# EAGLE design papertape_pcb (EAGLE 7.6.0)
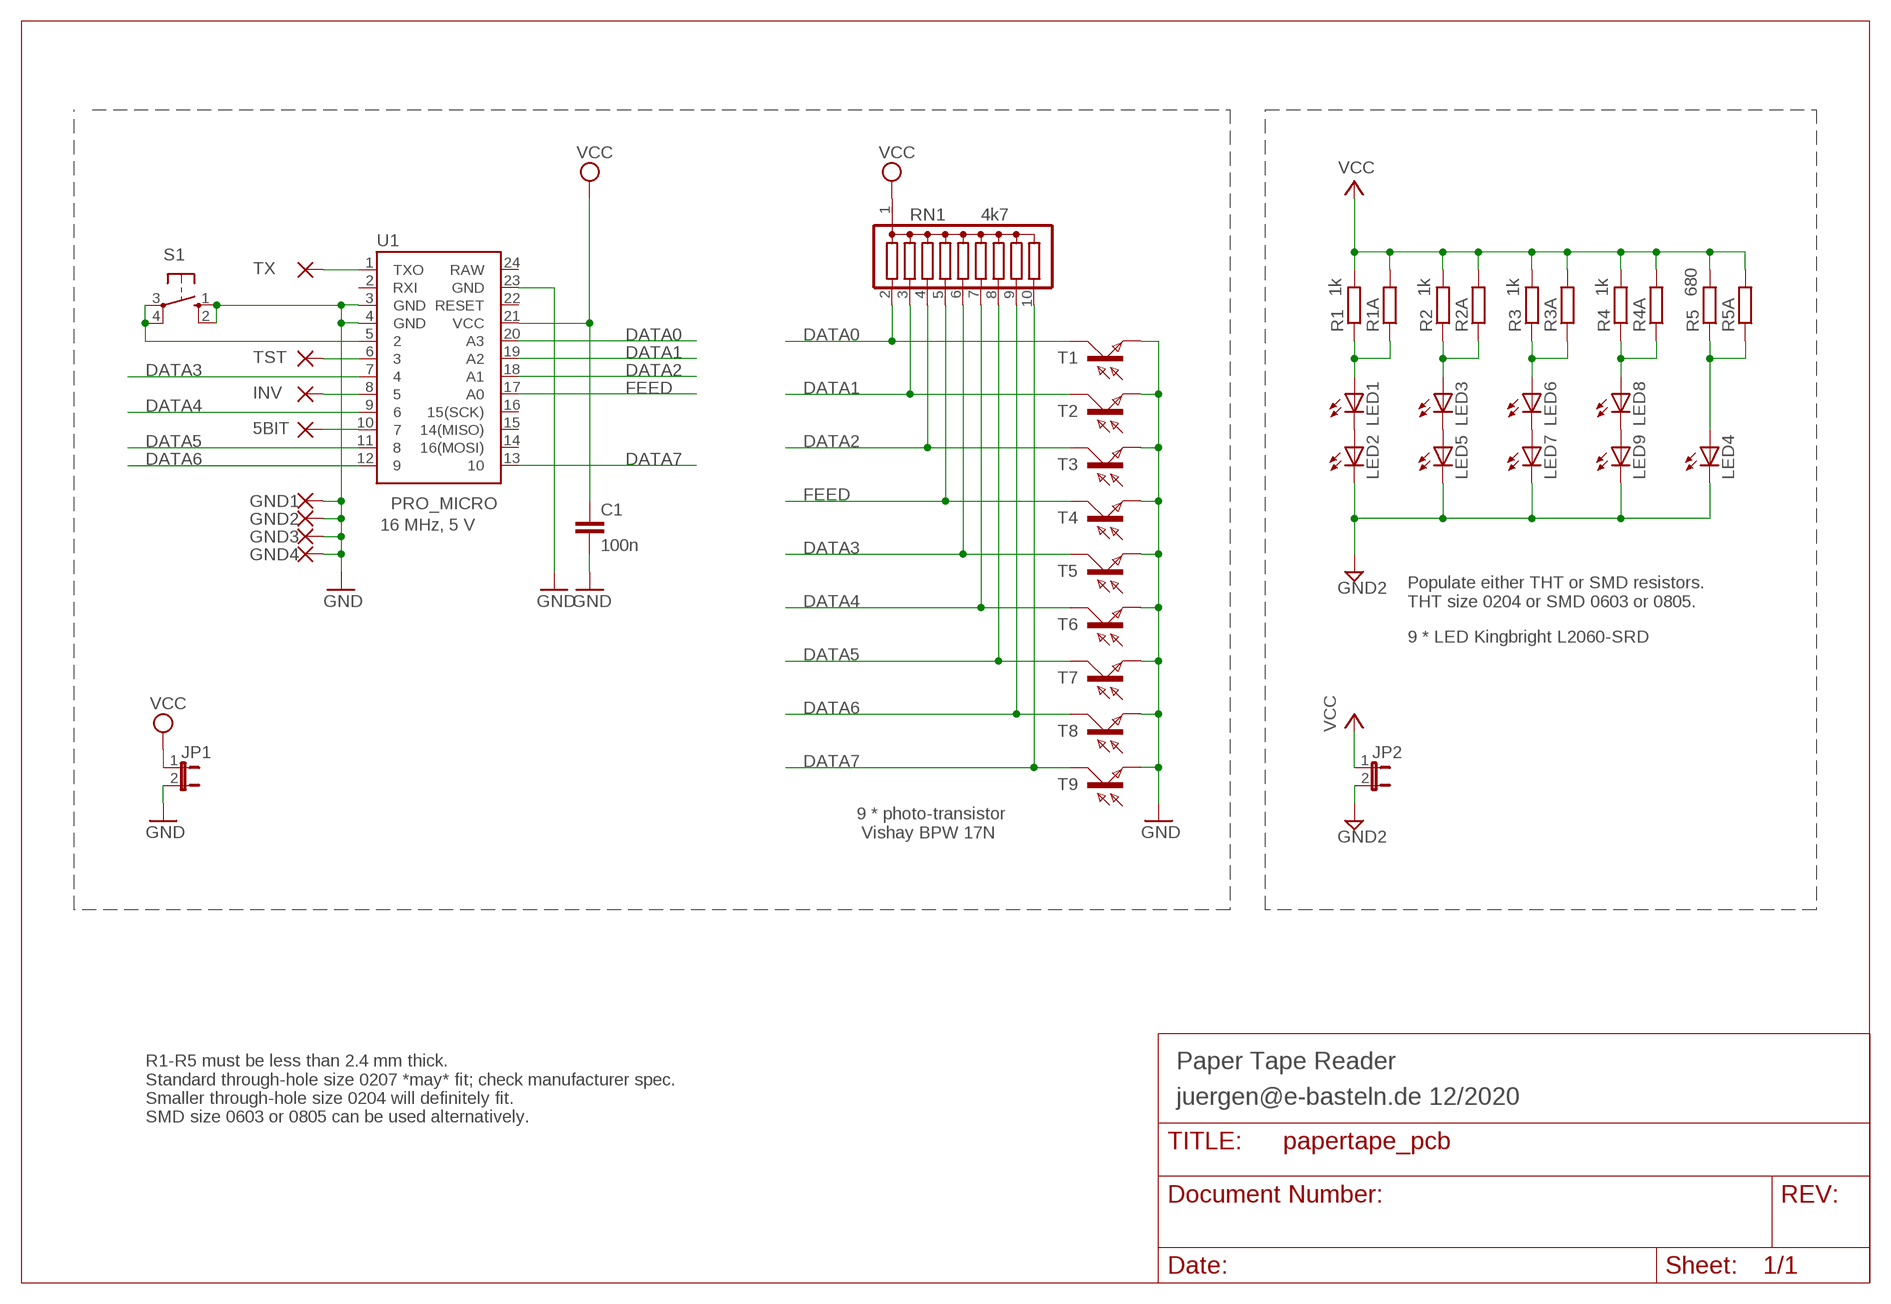
[diagram p0: schematic, sheet 1]

## Parts
5BIT  1,6/0,8  [1,6/0,8]
C1  100n  C-EU025-024X044  [C025-024X044]
GND1  1,6/0,8  [1,6/0,8]
GND2  1,6/0,8  [1,6/0,8]
GND3  1,6/0,8  [1,6/0,8]
GND4  1,6/0,8  [1,6/0,8]
INV  1,6/0,8  [1,6/0,8]
JP1  JP1E  [JP1]
JP2  JP1E  [JP1]
LED1  LEDLED1MM8  [LED1MM8]
LED2  LEDLED1MM8  [LED1MM8]
LED3  LEDLED1MM8  [LED1MM8]
LED4  LEDLED1MM8  [LED1MM8]
LED5  LEDLED1MM8  [LED1MM8]
LED6  LEDLED1MM8  [LED1MM8]
LED7  LEDLED1MM8  [LED1MM8]
LED8  LEDLED1MM8  [LED1MM8]
LED9  LEDLED1MM8  [LED1MM8]
R1  1k  R-EU_0204/7  [0204/7]
R1A  R-EU_R0805  [R0805]
R2  1k  R-EU_0204/7  [0204/7]
R2A  R-EU_R0805  [R0805]
R3  1k  R-EU_0204/7  [0204/7]
R3A  R-EU_R0805  [R0805]
R4  1k  R-EU_0204/7  [0204/7]
R4A  R-EU_R0805  [R0805]
R5  680  R-EU_0204/7  [0204/7]
R5A  R-EU_R0805  [R0805]
RN1  4k7  G09R  [SIL10]
S1  10-XX  [B3F-10XX]
T1  BPW17N  [BPW17N]
T2  BPW17N  [BPW17N]
T3  BPW17N  [BPW17N]
T4  BPW17N  [BPW17N]
T5  BPW17N  [BPW17N]
T6  BPW17N  [BPW17N]
T7  BPW17N  [BPW17N]
T8  BPW17N  [BPW17N]
T9  BPW17N  [BPW17N]
TST  1,6/0,8  [1,6/0,8]
TX  1,6/0,8  [1,6/0,8]
U1  PRO_MICRO  SPARKFUN_PRO_MICRO  [SPARKFUN_PRO_MICRO]

## Nets
DATA0: RN1.2 T1.C U1.20(A3)
DATA1: RN1.3 T2.C U1.19(A2)
DATA2: RN1.4 T3.C U1.18(A1)
DATA3: RN1.6 T5.C U1.7
DATA4: RN1.7 T6.C U1.9
DATA5: RN1.8 T7.C U1.11
DATA6: RN1.9 T8.C U1.12
DATA7: RN1.10 T9.C U1.13
FEED: RN1.5 T4.C U1.17(A0)
GND: C1.2 GND1.1(P) GND2.1(P) GND3.1(P) GND4.1(P) JP1.2 S1.1(S) S1.2(S1) T1.E T2.E T3.E T4.E T5.E T6.E T7.E T8.E T9.E U1.3(GND) U1.4(GND) U1.23(GND)
GND2: JP2.2 LED2.K(C) LED4.K(C) LED5.K(C) LED7.K(C) LED9.K(C)
N$1: LED1.K(C) LED2.A
N$2: LED3.K(C) LED5.A
N$3: LED6.K(C) LED7.A
N$4: LED8.K(C) LED9.A
N$5: INV.1(P) U1.8
N$6: TST.1(P) U1.6
N$9: LED4.A R5.1 R5A.1
N$10: TX.1(P) U1.1(TXO)
N$12: 5BIT.1(P) U1.10
N$21: S1.3(P) S1.4(P1) U1.5
N$30: LED1.A R1.1 R1A.1
N$31: LED3.A R2.1 R2A.1
N$32: LED6.A R3.1 R3A.1
N$33: LED8.A R4.1 R4A.1
VCC: C1.1 JP1.1 RN1.1 U1.21(VCC)
VCC2: JP2.1 R1.2 R1A.2 R2.2 R2A.2 R3.2 R3A.2 R4.2 R4A.2 R5.2 R5A.2 ; supply symbol labelled VCC
Unconnected: U1.2(RXI) U1.14(16(MOSI)) U1.15(14(MISO)) U1.16(15(SCK)) U1.22(RESET)

## Notes on the sheet
- 16 MHz, 5 V
- Populate either THT or SMD resistors.
  THT size 0204 or SMD 0603 or 0805.
- 9 * LED Kingbright L2060-SRD
- 9 * photo-transistor
   Vishay BPW 17N
- Paper Tape Reader
- juergen@e-basteln.de 12/2020
- R1-R5 must be less than 2.4 mm thick.
  Standard through-hole size 0207 *may* fit; check manufacturer spec.
  Smaller through-hole size 0204 will definitely fit.
  SMD size 0603 or 0805 can be used alternatively.

## Power pins joined to a net without a drawn wire
RAW: U1.24(RAW)

## Library data of the parts
5BIT GND1-GND4 INV TST TX = wirepad:1,6/0,8: THROUGH-HOLE PAD
C1 = rcl:C-EU: CAPACITOR, European symbol
JP1 JP2 = jumper:JP1E: JUMPER
LED1-LED9 = rsil9:LED: LED OSRAM: - CHIPLED LG R971, LG N971, LY N971, LG Q971, LY Q971, LO R971, LY R971 LH N974, LH R974 LS Q976, LO Q976, LY Q976 LO Q996 - Hyper CHIPLED LW Q18S LB Q993, LB Q99A, LB R99A - SideLED LS A670, LO A670, LY A670, LG A670, LP A670 LB A673, LV A673, LT A673, LW A673 LH A674 LY A675 LS A676, LA A676, LO A676, LY A676, LW A676 LS A679, LY A679, LG A679 - Hyper Micro SIDELED® LS Y876, LA Y876, LO Y876, LY Y876 LT Y87S - SmartLED LW L88C, LW L88S LB L89C, LB L89S, LG L890 LS L89K, LO L89K, LY L89K LS L896, LA L896, LO L896, LY L896 - TOPLED LS T670, LO T670, LY T670, LG T670, LP T670 LSG T670, LSP T670, LSY T670, LOP T670, LYG T670 LG T671, LOG T671, LSG T671 LB T673, LV T673, LT T673, LW T673 LH T674 LS T676, LA T676, LO T676, LY T676, LB T676, LH T676, LSB T676, LW T676 LB T67C, LV T67C, LT T67C, LS T67K, LO T67K, LY T67K, LW E67C LS E67B, LA E67B, LO E67B, LY E67B, LB E67C, LV E67C, LT E67C LW T67C LS T679, LY T679, LG T679 LS T770, LO T770, LY T770, LG T770, LP T770 LB T773, LV T773, LT T773, LW T773 LH T774 LS E675, LA E675, LY E675, LS T675 LS T776, LA T776, LO T776, LY T776, LB T776 LHGB T686 LT T68C, LB T68C - Hyper Mini TOPLED® LB M676 - Mini TOPLED Santana® LG M470 LS M47K, LO M47K, LY M47K Source: http://www.osram.convergy.de LUXEON: - LUMILED® LXK2-PW12-R00, LXK2-PW12-S00, LXK2-PW14-U00, LXK2-PW14-V00 LXK2-PM12-R00, LXK2-PM12-S00, LXK2-PM14-U00 LXK2-PE12-Q00, LXK2-PE12-R00, LXK2-PE12-S00, LXK2-PE14-T00, LXK2-PE14-U00 LXK2-PB12-K00, LXK2-PB12-L00, LXK2-PB12-M00, LXK2-PB14-N00, LXK2-PB14-P00, LXK2-PB14-Q00 LXK2-PR12-L00, LXK2-PR12-M00, LXK2-PR14-Q00, LXK2-PR14-R00 LXK2-PD12-Q00, LXK2-PD12-R00, LXK2-PD12-S00 LXK2-PH12-R00, LXK2-PH12-S00 LXK2-PL12-P00, LXK2-PL12-Q00, LXK2-PL12-R00 Source: www.luxeon.com KINGBRIGHT: KA-3528ASYC Source: www.kingbright.com
R1 R1A R2 R2A R3 R3A R4 R4A R5 R5A = rcl:R-EU_: RESISTOR, European symbol
RN1 = rsil9:G09R: SIL RESISTOR; OC_FARNELL: unknown; OC_NEWARK: unknown
S1 = switch-omron:10-XX: OMRON SWITCH; MPN: B3F-1000; OC_FARNELL: 176432; OC_NEWARK: 36M3542
T1-T9 = rsil9:BPW17N: PHOTO TRANSISTOR
U1 = jm-pro-micro:SPARKFUN_PRO_MICRO: SparkFun Pro Micro Atmega32U4 compatible footprint. SparkFun Products: 3.3V/8MHz <https://www.sparkfun.com/products/12587> 5V/16MHz <https://www.sparkfun.com/products/12640>

## Board
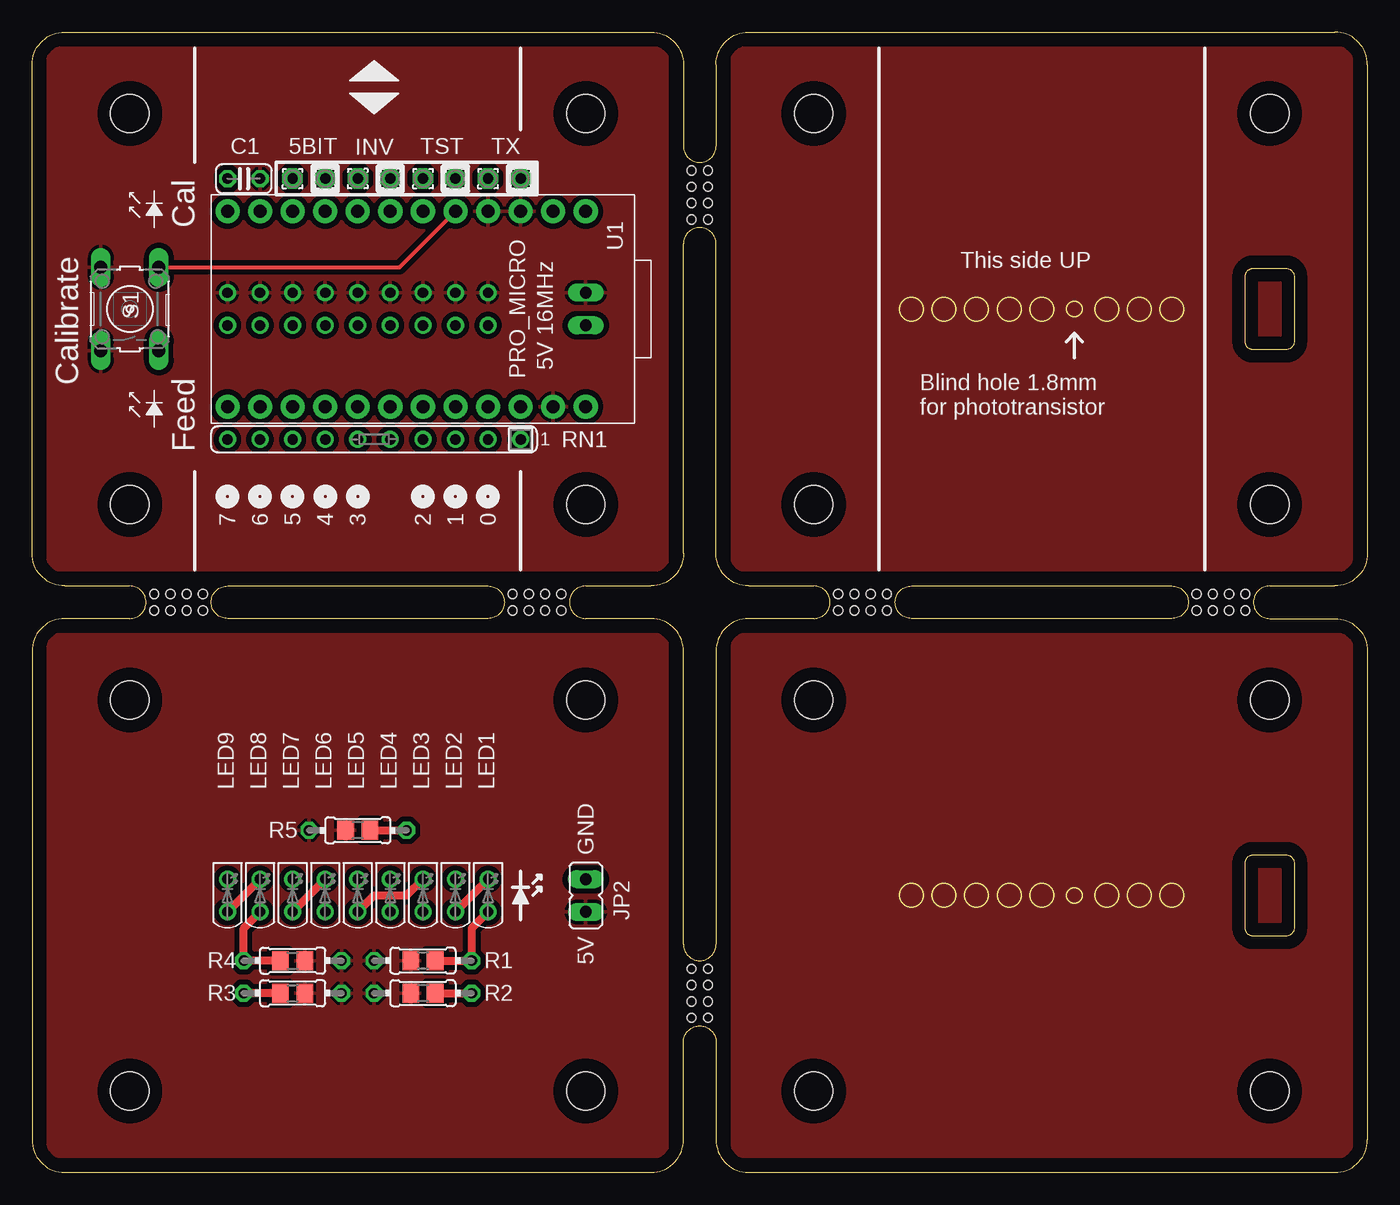
[diagram p1: board, top side]
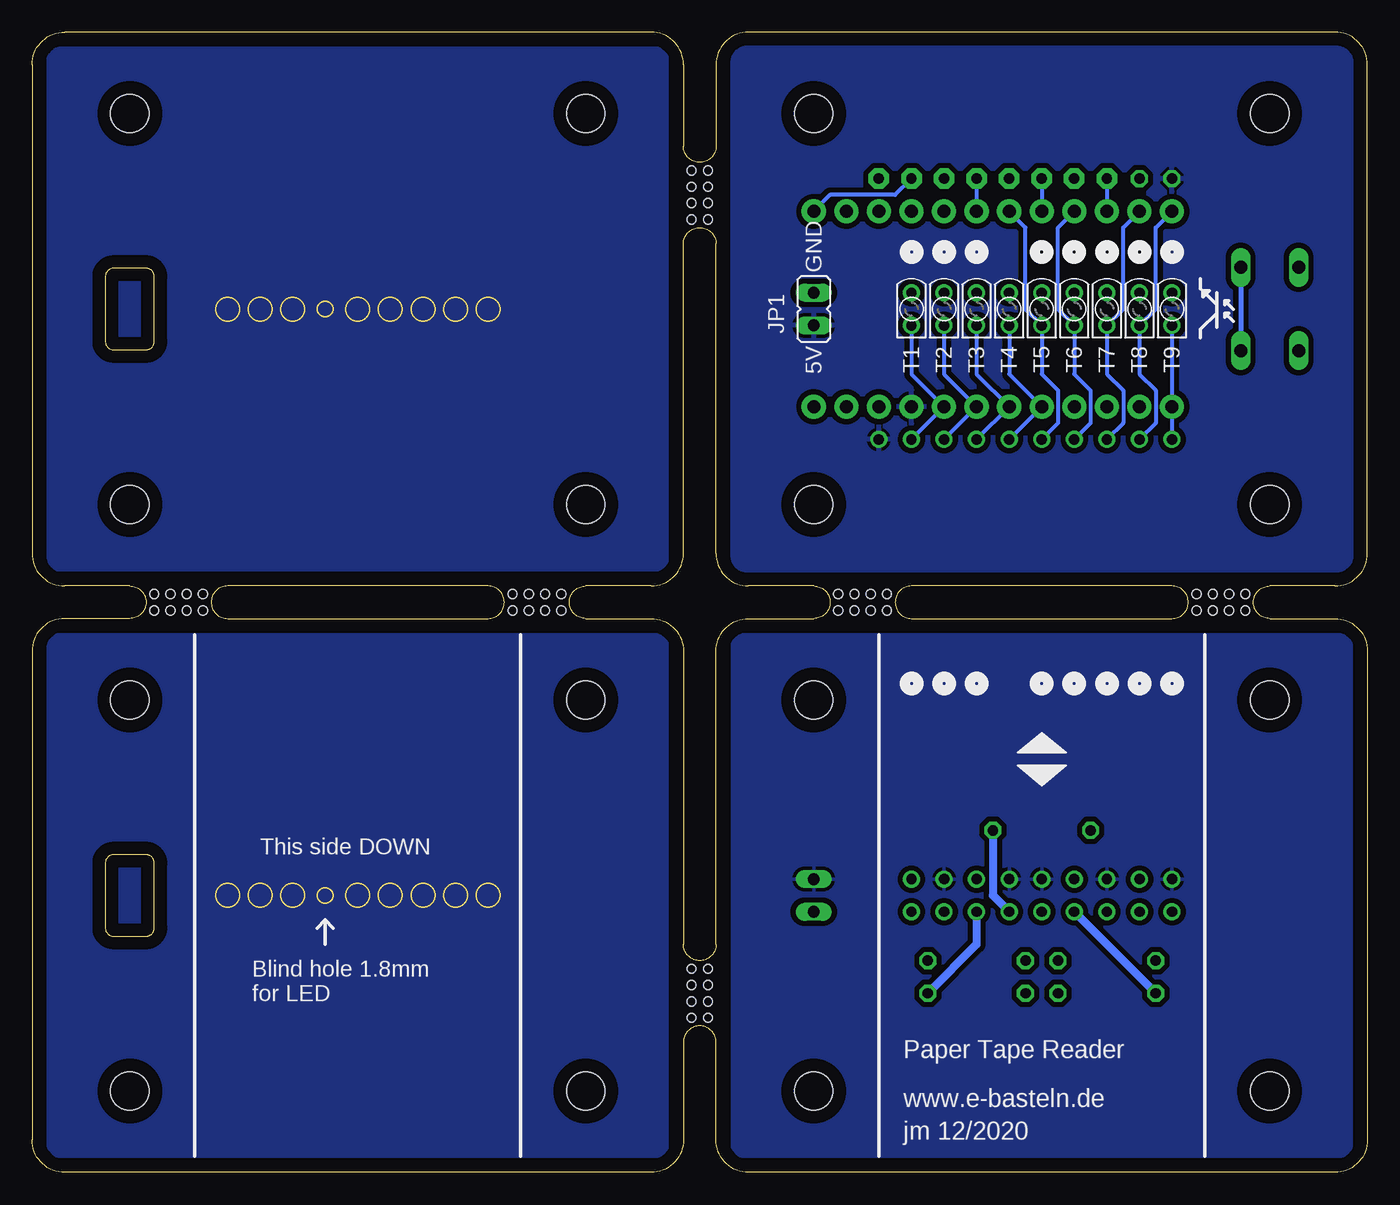
[diagram p2: board, bottom side, seen from below]

Size 104.14 x 88.9 mm. Coordinates in mm from the lower left corner, seen from the top.
Outline: 94.61,69.85 arc-90 95.25,70.48
Outline: 97.79,70.48 arc-90 98.42,69.85
Outline: 98.42,64.77 arc-90 97.79,64.14
Outline: 95.25,64.14 arc-90 94.61,64.77
Outline: 52.07,16.51 arc-90 50.8,17.78 50.8,40.64 arc90 48.26,43.18 43.18,43.18 arc-90 41.91,44.45 arc-90 43.18,45.72 48.26,45.72 arc90 50.8,48.26 50.8,72.39 arc-90 52.07,73.66 arc-90 53.34,72.39 53.34,48.26 arc90 55.88,45.72 60.96,45.72 arc-90 62.23,44.45 arc-90 60.96,43.18 55.88,43.18 arc90 53.34,40.64 53.34,17.78
Outline: 52.07,16.51 arc90 53.34,17.78
Outline: 52.07,11.43 arc90 50.8,10.16 50.8,2.54 arc-90 48.26,0 2.54,0 arc-90 0,2.54 0,40.64 arc-90 2.54,43.18 7.62,43.18 arc90 8.89,44.45 arc90 7.62,45.72 2.54,45.72 arc-90 0,48.26 0,86.36 arc-90 2.54,88.9 48.26,88.9 arc-90 50.8,86.36 50.8,80.01 arc90 52.07,78.74 arc90 53.34,80.01 53.34,86.36 arc-90 55.88,88.9 101.6,88.9 arc-90 104.14,86.36 104.14,48.26 arc-90 101.6,45.72 96.52,45.72 arc90 95.25,44.45 arc90 96.52,43.18 101.6,43.18 arc-90 104.14,40.64 104.14,2.54 arc-90 101.6,0 55.88,0 arc-90 53.34,2.54 53.34,10.16
Outline: 52.07,11.43 arc-90 53.34,10.16
Outline: 94.61,64.77 94.61,69.85
Outline: 94.61,69.85 arc-90 95.25,70.48
Outline: 95.25,70.48 97.79,70.48
Outline: 97.79,70.48 arc-90 98.42,69.85
Outline: 98.42,69.85 98.42,64.77
Outline: 98.42,64.77 arc-90 97.79,64.14
Outline: 97.79,64.14 95.25,64.14
Outline: 95.25,64.14 arc-90 94.61,64.77
Outline: 52.07,16.51 arc90 53.34,17.78
Outline: 52.07,11.43 arc-90 53.34,10.16
Outline: 88.9,45.72 arc-90 90.17,44.45 arc-90 88.9,43.18 68.58,43.18 arc-90 67.31,44.45 arc-90 68.58,45.72 88.9,45.72
Outline: 94.61,19.05 94.61,24.13 arc-90 95.25,24.77 97.79,24.77 arc-90 98.42,24.13 98.42,19.05 arc-90 97.79,18.41 95.25,18.41 arc-90 94.61,19.05
Outline: 35.56,45.72 arc-90 36.83,44.45 arc-90 35.56,43.18 15.24,43.18 arc-90 13.97,44.45 arc-90 15.24,45.72 35.56,45.72
Copper layers (1*16): Top 0.035mm / dielectric 1.5mm / Bottom 0.035mm
Design rules "default *": minimum track width 10mil, minimum drill 20mil, track to track 6mil, track to pad 6mil, pad to pad 6mil, via to via 6mil, smd to smd 6mil, copper to edge 40mil, drill to drill 8mil, minimum pad ring 10mil, minimum via ring 8mil, stop-mask expansion 4mil, vias tented up to drill 1000mil, thermal gap 10mil
Holes 0.7 mm at 51.44,76.83 51.44,78.11 51.44,75.56 52.7,78.11 51.44,74.3 52.7,76.83 52.7,74.3 52.7,75.56 92.08,43.81 90.81,43.81 93.34,43.81 90.81,45.09 94.61,43.81 92.08,45.09 94.61,45.09 93.34,45.09 51.44,14.61 51.44,15.88 51.44,13.34 52.7,15.88 51.44,12.06 52.7,14.61 52.7,12.06 52.7,13.34 64.14,43.81 62.87,43.81 65.41,43.81 62.87,45.09 66.67,43.81 64.14,45.09 66.67,45.09 65.41,45.09 38.73,43.81 37.47,43.81 40.01,43.81 37.47,45.09 41.27,43.81 38.73,45.09 41.27,45.09 40.01,45.09 10.79,43.81 9.53,43.81 12.06,43.81 9.53,45.09 13.34,43.81 10.79,45.09 13.34,45.09 12.06,45.09
Holes 3 mm at 7.62,82.55 43.18,82.55 43.18,52.07 7.62,52.07 7.62,36.83 43.18,36.83 7.62,6.35 43.18,6.35 60.96,6.35 96.52,6.35 96.52,36.83 60.96,36.83 60.96,82.55 60.96,52.07 96.52,52.07 96.52,82.55
Milling: area 67.7,20.7 to 69.5,22.5; area 80.7,21 to 81.9,22.2; area 67.7,66.4 to 69.5,68.2; area 80.7,66.7 to 81.9,67.9; area 70.2,20.7 to 72,22.5; area 72.7,20.7 to 74.6,22.5; area 75.3,20.7 to 77.1,22.5; area 77.8,20.7 to 79.7,22.5; area 82.9,20.7 to 84.7,22.5; area 85.4,20.7 to 87.3,22.5; area 88,20.7 to 89.8,22.5; area 70.2,66.4 to 72,68.2; area 72.7,66.4 to 74.6,68.2; area 75.3,66.4 to 77.1,68.2; area 77.8,66.4 to 79.7,68.2; area 82.9,66.4 to 84.7,68.2; area 85.4,66.4 to 87.3,68.2; area 88,66.4 to 89.8,68.2

### Footprints (pad centres in the part's own frame; a part is rotated, then mirrored left to right if it is on the bottom)
1,6/0,8 = drill 0.813 pad 1.6 octagon: 1 0,0
C025-024X044 = drill 0.813 octagon: 1 -1.27,0; 2 1.27,0
JP1 = drill 0.914 long: 1 0,-1.27; 2 0,1.27
LED1MM8 = drill 0.813: A -1.27,0; K 1.27,0
0204/7 = drill 0.813 octagon: 1 -3.81,0; 2 3.81,0
R0805 = smd 1.3 x 1.5: 1 -0.95,0; 2 0.95,0
SIL10 = drill 0.813: 1 -11.43,0; 2 -8.89,0; 3 -6.35,0; 4 -3.81,0; 5 -1.27,0; 6 1.27,0; 7 3.81,0; 8 6.35,0; 9 8.89,0; 10 11.43,0
B3F-10XX = drill 1.016 long: 1 -3.251,2.261; 2 3.251,2.261; 3 -3.251,-2.261; 4 3.251,-2.261
BPW17N = drill 0.813: C 1.27,0; E -1.27,0
SPARKFUN_PRO_MICRO = drill 1.016 pad 1.88: 1 -7.62,12.7; 2 -7.62,10.16; 3 -7.62,7.62; 4 -7.62,5.08; 5 -7.62,2.54; 6 -7.62,0; 7 -7.62,-2.54; 8 -7.62,-5.08; 9 -7.62,-7.62; 10 -7.62,-10.16; 11 -7.62,-12.7; 12 -7.62,-15.24; 13 7.62,-15.24; 14 7.62,-12.7; 15 7.62,-10.16; 16 7.62,-7.62; 17 7.62,-5.08; 18 7.62,-2.54; 19 7.62,0; 20 7.62,2.54; 21 7.62,5.08; 22 7.62,7.62; 23 7.62,10.16; 24 7.62,12.7

### Placement (x,y rotation side)
5BIT  20.32,77.47 90 top
C1  16.51,77.47 0 top
GND1  33.02,77.47 90 top
GND2  38.1,77.47 90 top
GND3  22.86,77.47 90 top
GND4  27.94,77.47 0 top
INV  25.4,77.47 0 top
JP1  43.18,67.31 0 bottom
JP2  43.18,21.59 0 top
LED1  35.56,21.59 90 top
LED2  33.02,21.59 90 top
LED3  30.48,21.59 90 top
LED4  27.94,21.59 90 top
LED5  25.4,21.59 90 top
LED6  22.86,21.59 90 top
LED7  20.32,21.59 90 top
LED8  17.78,21.59 90 top
LED9  15.24,21.59 90 top
R1  30.48,16.51 180 top
R1A  30.48,16.51 180 top
R2  30.48,13.97 180 top
R2A  30.48,13.97 180 top
R3  20.32,13.97 0 top
R3A  20.32,13.97 0 top
R4  20.32,16.51 0 top
R4A  20.32,16.51 0 top
R5  25.4,26.67 180 top
R5A  25.4,26.67 180 top
RN1  26.67,57.15 180 top
S1  7.62,67.31 90 top
T1  35.56,67.31 270 bottom
T2  33.02,67.31 270 bottom
T3  30.48,67.31 270 bottom
T4  27.94,67.31 270 bottom
T5  25.4,67.31 270 bottom
T6  22.86,67.31 270 bottom
T7  20.32,67.31 270 bottom
T8  17.78,67.31 270 bottom
T9  15.24,67.31 270 bottom
TST  30.48,77.47 90 top
TX  35.56,77.47 90 top
U1  30.48,67.31 270 top

### Tracks (layer width: path | path; a pad name or v marks a point on that pad's centre or on a via)
DATA0
  Bottom 0.305: RN1.2 U1.20 35.56,62.23 T1.C
DATA1
  Bottom 0.305: RN1.3 U1.19 33.02,62.23 T2.C
DATA2
  Bottom 0.305: RN1.4 U1.18 30.48,62.23 T3.C
DATA3
  Bottom 0.305: RN1.6 24.13,58.42 24.13,60.96 25.4,62.23 T5.C 26.67,67.31 26.67,73.66 U1.7
DATA4
  Bottom 0.305: RN1.7 21.59,58.42 21.59,60.96 22.86,62.23 T6.C 24.13,67.31 24.13,73.66 U1.9
DATA5
  Bottom 0.305: RN1.8 19.05,58.42 19.05,60.96 20.32,62.23 T7.C 19.05,67.31 19.05,73.66 U1.11
DATA6
  Bottom 0.305: RN1.9 16.51,58.42 16.51,60.96 17.78,62.23 T8.C 16.51,67.31 16.51,73.66 U1.12
DATA7
  Bottom 0.305: T9.C U1.13 RN1.10
FEED
  Bottom 0.305: RN1.5 U1.17 27.94,62.23 T4.C
GND
  pour Top (isolate 0.406): 1.27,87.63 1.27,46.99 49.53,46.99 49.53,87.63
GND2
  pour Bottom (isolate 0.406): 49.53,41.91 1.27,41.91 1.27,1.27 49.53,1.27
MASK1
  pour Bottom (isolate 0.406): 102.87,87.63 102.87,46.99 54.61,46.99 54.61,87.63
  pour Top (isolate 0.406): 102.87,46.99 54.61,46.99 54.61,87.63 102.87,87.63
MASK2
  pour Top (isolate 0.406): 102.87,1.27 54.61,1.27 54.61,41.91 102.87,41.91
  pour Bottom (isolate 0.406): 102.87,41.91 54.61,41.91 54.61,1.27 102.87,1.27
N$1
  Top 0.61: LED2.A LED1.K
N$2
  Top 0.61: LED5.A 26.67,21.59 29.21,21.59 LED3.K
N$3
  Top 0.61: LED7.A LED6.K
N$4
  Top 0.61: LED9.A LED8.K
N$5
  Bottom 0.305: INV.1 U1.8
N$6
  Bottom 0.305: TST.1 U1.6
N$9
  Top 0.61: R5A.1 R5.1
  Bottom 0.61: R5.1 29.21,21.59 LED4.A
N$10
  Bottom 0.305: TX.1 36.83,76.2 41.91,76.2 U1.1
N$12
  Bottom 0.305: 5BIT.1 U1.10
N$21
  Top 0.305: S1.4 28.65,70.56 U1.5
  Bottom 0.406: S1.4 S1.3
N$30
  Top 0.61: LED1.A 34.29,19.05 R1.1 R1A.1
N$31
  Top 0.61: R2A.1 R2.1
  Bottom 0.61: LED3.A 30.48,17.78 R2.1
N$32
  Top 0.61: R3A.1 R3.1
  Bottom 0.61: LED6.A R3.1
N$33
  Top 0.61: LED8.A 16.51,19.05 R4.1 R4A.1
VCC
  pour Bottom (isolate 0.406): 1.27,87.63 49.53,87.63 49.53,46.99 1.27,46.99
VCC2
  pour Top (isolate 0.406): 49.53,1.27 1.27,1.27 1.27,41.91 49.53,41.91

### Text on the board
tPlace: Cal | This side UP | 5V 16MHz | Calibrate | Blind hole 1.8mm / for phototransistor | Feed | 7 | 6 | 5 | 4 | 3 | 2 | 1 | 0 | GND | 5V
bPlace: GND | 5V | This side DOWN | Blind hole 1.8mm / for LED | Paper Tape Reader | www.e-basteln.de | jm 12/2020
tDocu: 1.6 mm PCB strength